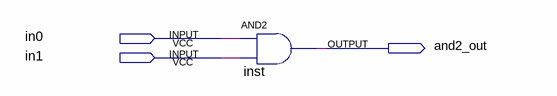
[diagram p0: schematic sheet]
// Quartus schematic test.bdf as structural Verilog: 1 symbols, 3 pins
module test (
  input  in0,
  input  in1,
  output and2_out
);

  and inst (and2_out, in0, in1);
endmodule
